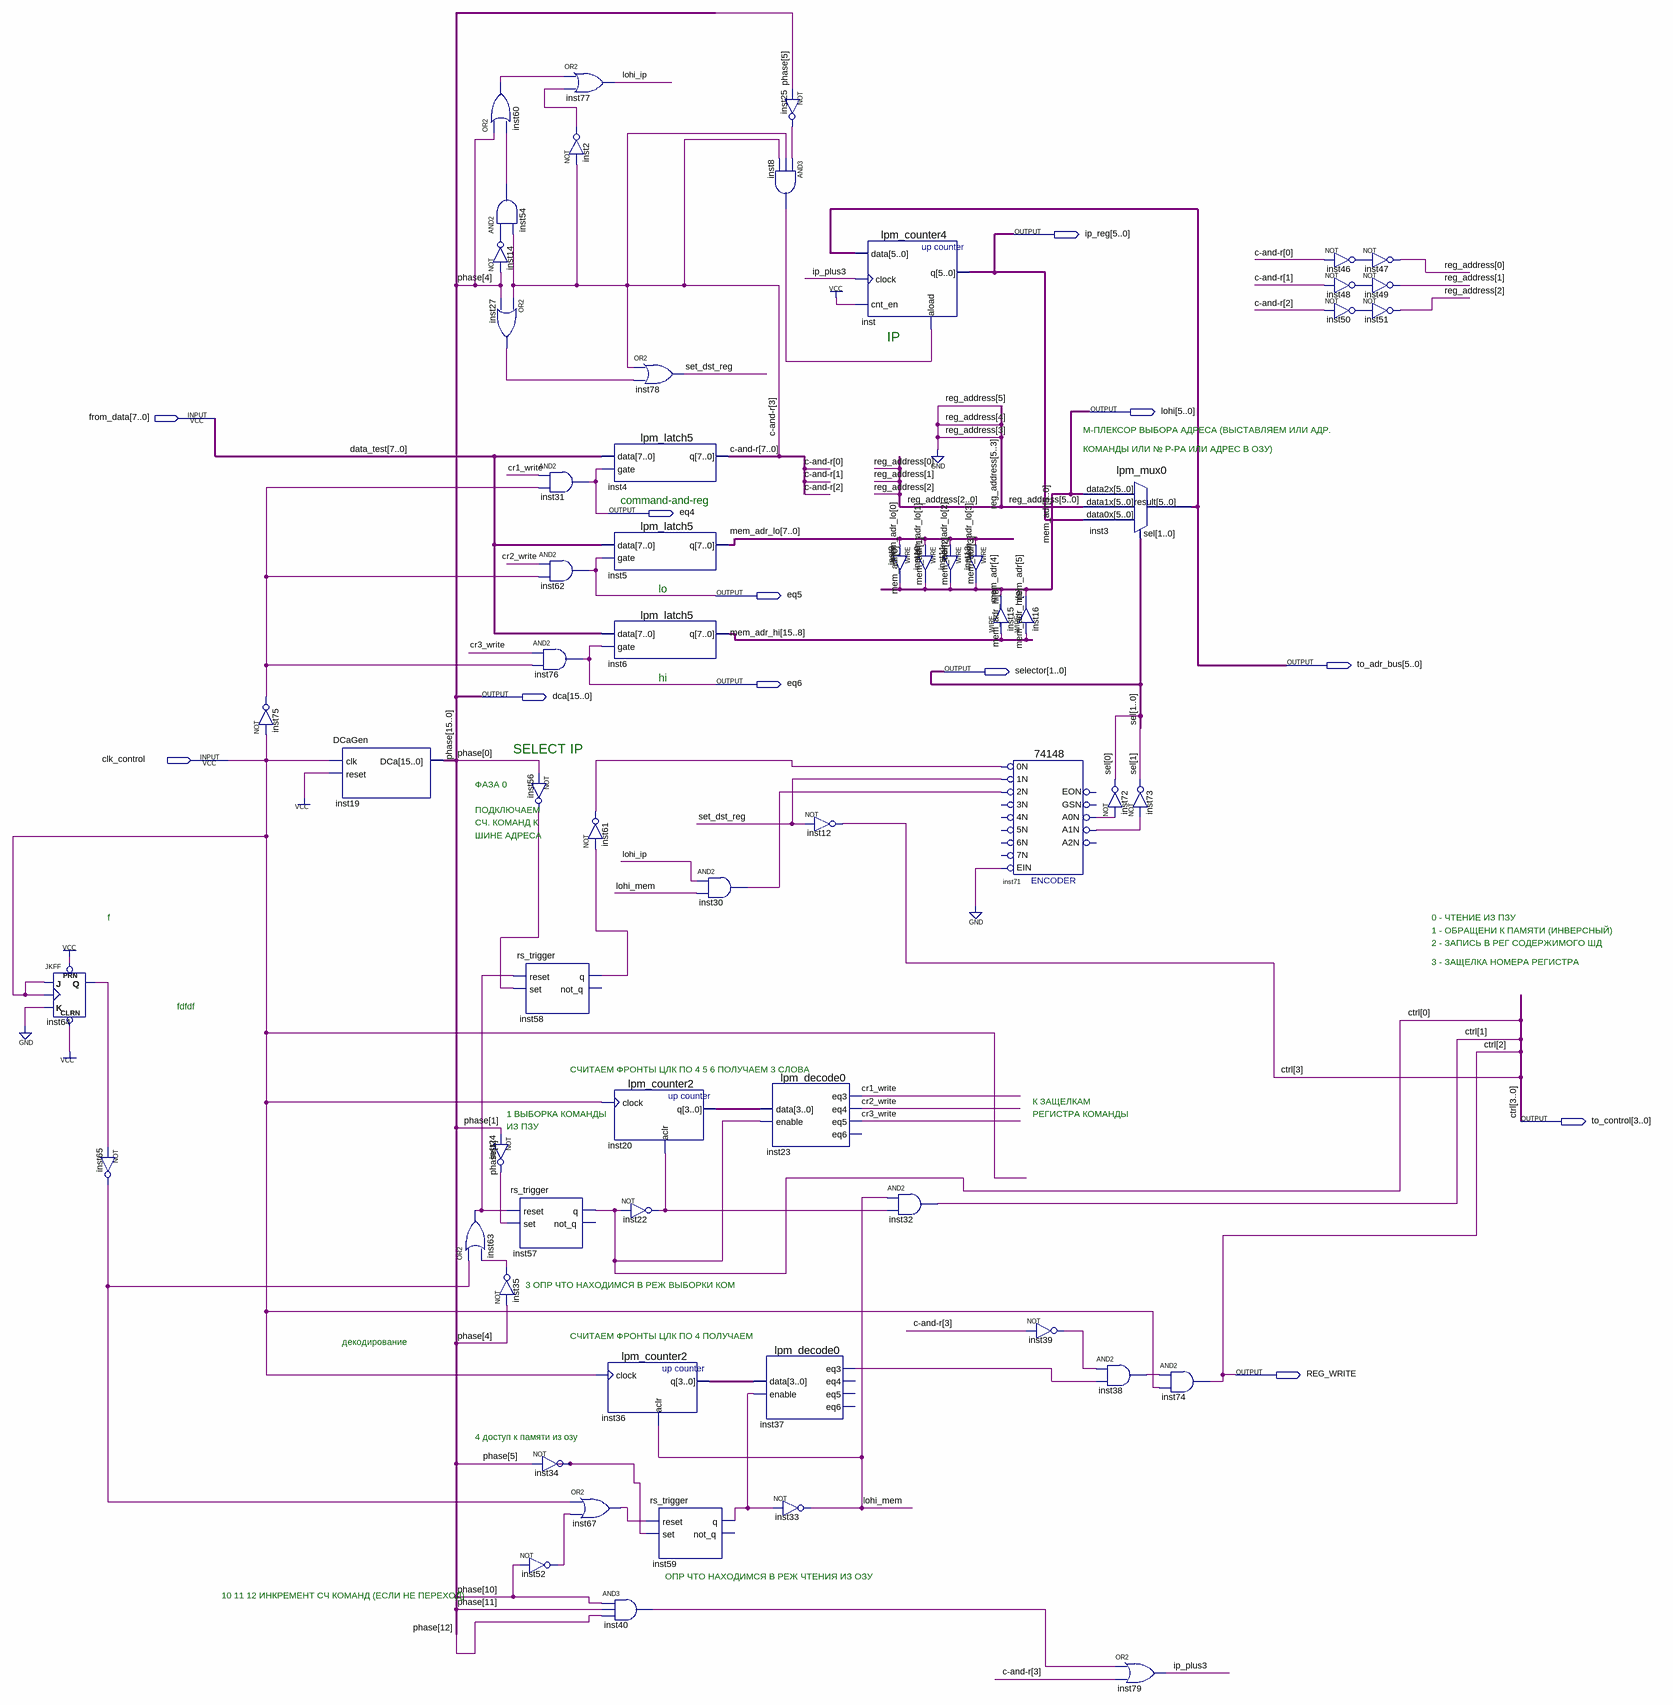
[diagram p0: schematic sheet]
// Quartus schematic control.bdf as structural Verilog: 61 symbols, 12 pins
module control (
  input  [7:0] from_data,
  input  clk_control,
  output [5:0] ip_reg,
  output [5:0] lohi,
  output eq4,
  output eq5,
  output [5:0] to_adr_bus,
  output [1:0] selector,
  output eq6,
  output [15:0] dca,
  output [3:0] to_control,
  output REG_WRITE
);

  wire cr1_write, cr2_write, cr3_write, inst2_out, inst8_out, inst14_out, inst22_out, inst24_out, inst25_out,
       inst27_out, inst30_out, inst34_out, inst35_out, inst37_eq3, inst38_out, inst39_out, inst40_out,
       inst46_out, inst48_out, inst50_out, inst52_out, inst54_out, inst56_out, inst58_q, inst59_q,
       inst60_out, inst61_out, inst63_out, inst64_q, inst65_out, inst67_out, inst71_a0n, inst71_a1n,
       inst75_out, ip_plus3, lohi_ip, lohi_mem, set_dst_reg;
  wire [2:0] reg_address;
  wire [3:0] inst20_q, inst36_q;
  wire [7:0] \c-and-r , mem_adr_lo;
  wire [15:8] mem_adr_hi;

  JKFF inst64 (.PRN(1'b1), .CLRN(1'b1), .K(1'b0), .J(clk_control), .CLK(clk_control), .Q(inst64_q));
  not inst65 (inst65_out, inst64_q);
  not inst75 (inst75_out, clk_control);
  DCaGen inst19 (.clk(clk_control), .reset(1'b1), .DCa(dca));
  or inst63 (inst63_out, inst65_out, inst35_out);
  or inst60 (inst60_out, dca[4], inst54_out);
  and inst54 (inst54_out, inst14_out, \c-and-r [3]);
  not inst14 (inst14_out, dca[4]);
  or inst27 (inst27_out, \c-and-r [3], dca[4]);
  rs_trigger inst58 (.reset(inst63_out), .set(inst56_out), .q(inst58_q));  // open: not_q
  not inst24 (inst24_out, dca[1]);
  rs_trigger inst57 (.reset(inst63_out), .set(inst24_out), .q(to_control[0]));  // open: not_q
  not inst35 (inst35_out, dca[4]);
  not inst52 (inst52_out, dca[10]);
  or inst77 (lohi_ip, inst60_out, inst2_out);
  not inst2 (inst2_out, \c-and-r [3]);
  and inst31 (eq4, cr1_write, inst75_out);
  and inst62 (eq5, cr2_write, inst75_out);
  and inst76 (eq6, cr3_write, inst75_out);
  not inst56 (inst56_out, dca[0]);
  not inst34 (inst34_out, dca[5]);
  or inst67 (inst67_out, inst65_out, inst52_out);
  lpm_latch5 inst4 (.data(from_data), .gate(eq4), .q(\c-and-r ));
  lpm_latch5 inst5 (.data(from_data), .gate(eq5), .q(mem_adr_lo));
  lpm_latch5 inst6 (.data(from_data), .gate(eq6), .q(mem_adr_hi));
  not inst61 (inst61_out, inst58_q);
  lpm_counter2 inst20 (.clock(clk_control), .aclr(inst22_out), .q(inst20_q));
  not inst22 (inst22_out, to_control[0]);
  lpm_counter2 inst36 (.clock(clk_control), .aclr(lohi_mem), .q(inst36_q));
  and inst40 (inst40_out, dca[10], dca[11], dca[12]);
  or inst78 (set_dst_reg, \c-and-r [3], inst27_out);
  rs_trigger inst59 (.reset(inst67_out), .set(inst34_out), .q(inst59_q));  // open: not_q
  and inst30 (inst30_out, lohi_ip, lohi_mem);
  and inst8 (inst8_out, inst25_out, \c-and-r [3], \c-and-r [3]);
  lpm_decode0 inst23 (
    .data(inst20_q), .enable(to_control[0]), .eq3(cr1_write), .eq4(cr2_write), .eq5(cr3_write));  // open: eq6
  lpm_decode0 inst37 (.data(inst36_q), .enable(inst59_q), .eq3(inst37_eq3));  // open: eq4, eq5, eq6
  not inst33 (lohi_mem, inst59_q);
  not inst25 (inst25_out, dca[5]);
  not inst12 (to_control[3], set_dst_reg);
  lpm_counter4 inst (.data(to_adr_bus), .clock(ip_plus3), .cnt_en(1'b1), .aload(inst8_out), .q(ip_reg));
  assign lohi[0] = mem_adr_lo[0];  // WIRE inst9
  assign lohi[1] = mem_adr_lo[1];  // WIRE inst10
  and inst32 (to_control[1], lohi_mem, inst22_out);
  assign lohi[2] = mem_adr_lo[2];  // WIRE inst11
  assign lohi[3] = mem_adr_lo[3];  // WIRE inst13
  assign lohi[4] = mem_adr_hi[8];  // WIRE inst15
  assign lohi[5] = mem_adr_hi[9];  // WIRE inst16
  \74148  inst71 (
    .\0N (inst61_out), .\1N (set_dst_reg), .\2N (inst30_out), .EIN(1'b0), .A1N(inst71_a1n), .A0N(inst71_a0n));  // open: 5N, 3N, 4N, 6N, 7N, A2N, EON, GSN
  not inst39 (inst39_out, \c-and-r [3]);
  lpm_mux0 inst3 (.data2x(lohi), .data1x({3'b000, reg_address}), .data0x(ip_reg), .sel(selector), .result(to_adr_bus));
  not inst72 (selector[0], inst71_a0n);
  not inst73 (selector[1], inst71_a1n);
  and inst38 (inst38_out, inst39_out, inst37_eq3);
  or inst79 (ip_plus3, inst40_out, \c-and-r [3]);
  and inst74 (REG_WRITE, inst38_out, clk_control);
  not inst46 (inst46_out, \c-and-r [0]);
  not inst48 (inst48_out, \c-and-r [1]);
  not inst50 (inst50_out, \c-and-r [2]);
  not inst47 (reg_address[0], inst46_out);
  not inst49 (reg_address[1], inst48_out);
  not inst51 (reg_address[2], inst50_out);

  assign to_control[2] = REG_WRITE;

  // Other names for the same wires on the sheet: ctrl[3:0] = {to_control[3], REG_WRITE, to_control[1:0]};
  //   data_test[7:0] = from_data; mem_adr[5:0] = lohi; phase[15:0] = dca; sel[1:0] = selector

  // Notes on the sheet:
  //   IP
  //   М-ПЛЕКСОР ВЫБОРА АДРЕСА (ВЫСТАВЛЯЕМ ИЛИ АДР.
  //   КОМАНДЫ ИЛИ № Р-РА ИЛИ АДРЕС В ОЗУ)
  //   command-and-reg
  //   lo
  //   hi
  //   SELECT IP
  //   ФАЗА 0
  //   ПОДКЛЮЧАЕМ
  //   СЧ. КОМАНД К
  //   ШИНЕ АДРЕСА
  //   f
  //   0 - ЧТЕНИЕ ИЗ ПЗУ
  //   1 - ОБРАЩЕНИ К ПАМЯТИ (ИНВЕРСНЫЙ)
  //   2 - ЗАПИСЬ В РЕГ СОДЕРЖИМОГО ШД
  //   3 - ЗАЩЕЛКА НОМЕРА РЕГИСТРА
  //   fdfdf
  //   СЧИТАЕМ ФРОНТЫ ЦЛК ПО 4 5 6 ПОЛУЧАЕМ 3 СЛОВА
  //   К ЗАЩЕЛКАМ
  //   1 ВЫБОРКА КОМАНДЫ
  //   РЕГИСТРА КОМАНДЫ
  //   ИЗ ПЗУ
  //   3 ОПР ЧТО НАХОДИМСЯ В РЕЖ ВЫБОРКИ КОМ
  //   СЧИТАЕМ ФРОНТЫ ЦЛК ПО 4 ПОЛУЧАЕМ
  //   декодирование
  //   4 доступ к памяти из озу
  //   ОПР ЧТО НАХОДИМСЯ В РЕЖ ЧТЕНИЯ ИЗ ОЗУ
  //   10 11 12 ИНКРЕМЕНТ СЧ КОМАНД (ЕСЛИ НЕ ПЕРЕХОД)
endmodule
